# Altium schematic sheet Esquematico.SchDoc
size A4; SheetNumber: 1; SheetTotal: 2; SPICEModelCacheQUZINIZP: <root> / <DocumentId>QUZINIZP</DocumentId> / </root>
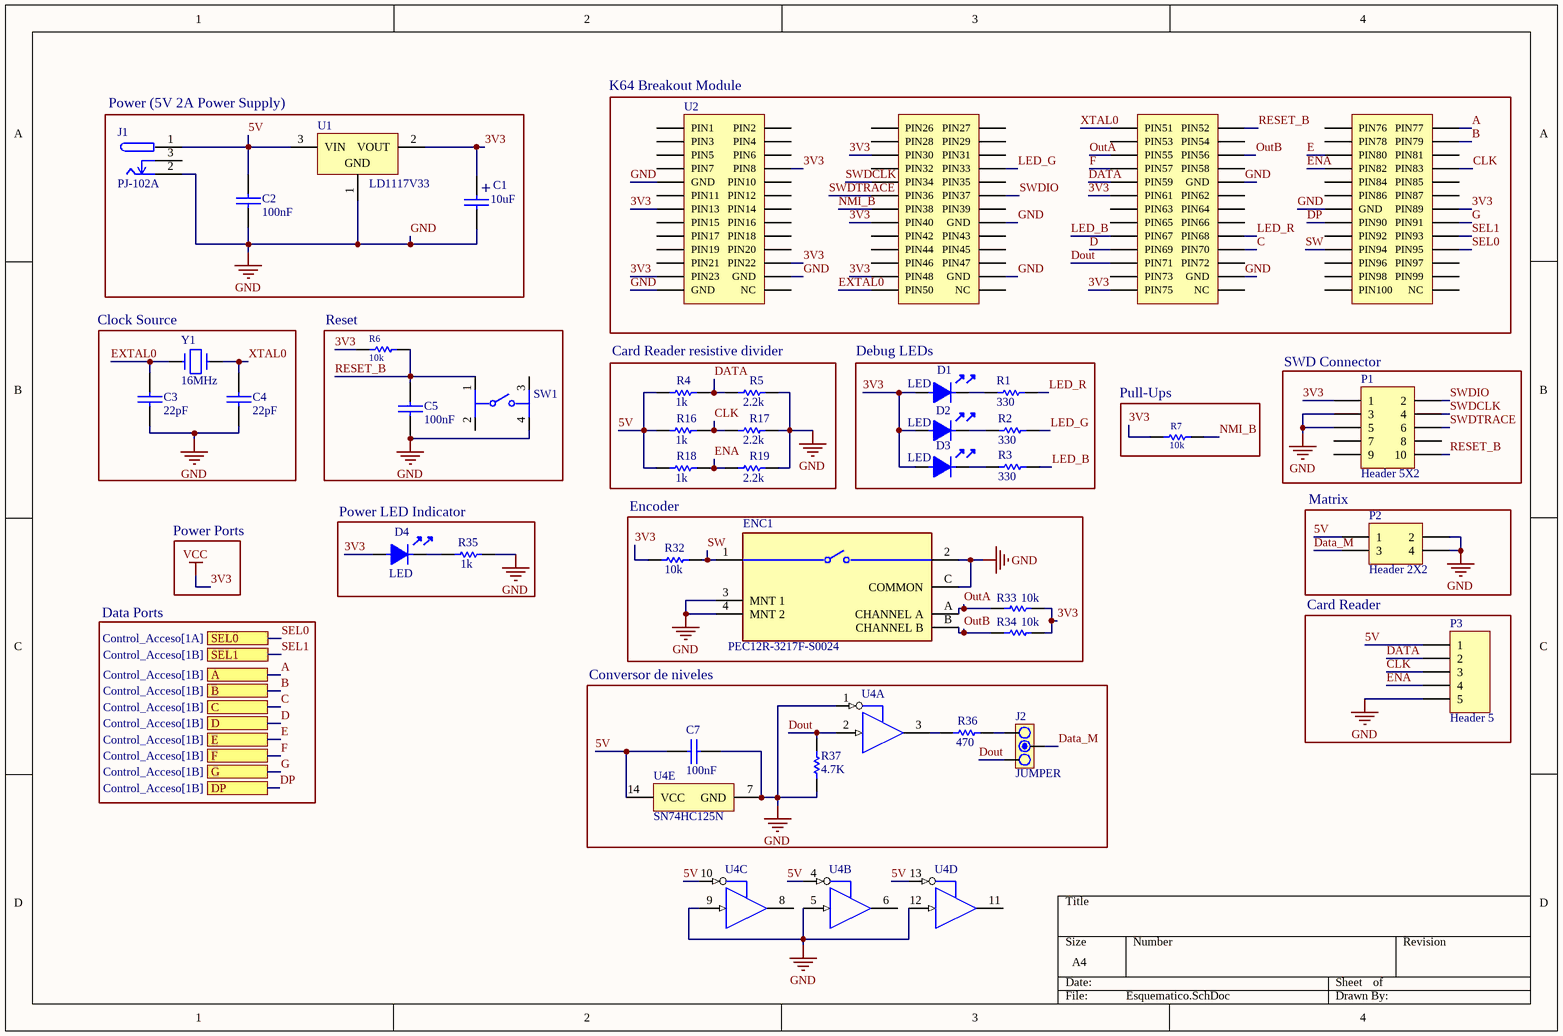
[diagram p0: Esquematico.SchDoc]

## Parts
C1  10uF  [CAP100RP]
C2  100nF  [CAP200]
C3  22pF  [CAP200]
C4  22pF  [CAP200]
C5  100nF  [CAP200]
C7  100nF  [CAP200]
D1  LED  [LED3]
D2  LED  [LED3]
D3  LED  [LED3]
D4  LED  [LED3]
ENC1  PEC12R-3217F-S0024  [FP-PEC12R-3217F-S0024-MFG]
J1  PJ-102A  [FP-PJ-102A-MFG]
J2  JUMPER  [JUMPER3]
P1  Header 5X2  [HDR2X5]
P2  Header 2X2  [HDR2X2]
P3  Header 5  [HDR1X5]
R1  330  [RES400]
R2  330  [RES400]
R3  330  [RES400]
R4  1k  [RES400]
R5  2.2k  [RES400]
R6  10k  [RES400]
R7  10k  [RES400]
R16  1k  [RES400]
R17  2.2k  [RES400]
R18  1k  [RES400]
R19  2.2k  [RES400]
R32  10k  [RES400]
R33  10k  [RES400]
R34  10k  [RES400]
R35  1k  [RES400]
R36  470  [RES400]
R37  4.7K  [RES400]
SW1  (no value)  [FP-B3F-1055-MFG]
U1  LD1117V33  [TO220]
U2  K64 Breakout Module  [Breakout]
U4  (no value)  [N0014A]  (parts A,B,C,D,E of 5)
Y1  16MHz  [CRISTAL PERFIL]

## Blocks framed on the sheet
Power (5V 2A Power Supply): C1 C2 J1 U1
Clock Source: C3 C4 Y1
Reset: C5 R6 SW1
Card Reader resistive divider: R4 R5 R16-R19
Debug LEDs: D1-D3 R1-R3
Pull-Ups: R7
SWD Connector: P1
Encoder: ENC1 R32-R34
Matrix: P2
Power LED Indicator: D4 R35
Card Reader: P3
Conversor de niveles: C7 J2 R36 R37 U4

## Ports
A (see Control_Acceso[1B]), B (see Control_Acceso[1B]), C (see Control_Acceso[1B]), D (see Control_Acceso[1B]), DP (see Control_Acceso[1B]), E (see Control_Acceso[1B]), F (see Control_Acceso[1B]), G (see Control_Acceso[1B]), SEL0 (see Control_Acceso[1A]), SEL1 (see Control_Acceso[1B])

## Nets
3V3: C1.1 D1.1 D2.1 D3.1 D4.1 P1.1 R6.2 R7.2 R32.1 R33.2 R34.1 U1.2(VOUT) U2.8(PIN8) U2.13(PIN13) U2.22(PIN22) U2.23(PIN23) U2.31(PIN30) U2.41(PIN40) U2.49(PIN48) U2.63(PIN61) U2.77(PIN75) U2.92(PIN89)  [also labelled VCC]
GND: C1.2 C2.2 C3.2 C4.2 C5.2 C7.2 ENC1.2 ENC1.3(MNT_1) ENC1.4(MNT_2) ENC1.C(COMMON) J1.2 P1.3 P1.5 P2.2 P2.4 P3.5 R5.2 R17.2 R19.2 R35.2 R37.1 SW1.4 U1.1(GND) U2.9(GND) U2.24(GND) U2.25(GND) U2.42(GND) U2.50(GND) U2.62(GND) U2.76(GND) U2.91(GND) U4.1(1~{OE}) U4.5(2A) U4.7(GND) U4.9(3A) U4.12(4A)
5V: C2.1 C7.1 J1.1 P2.1 P3.1 R4.1 R16.1 R18.1 U1.3(VIN) U4.4(2~{OE}) U4.10(3~{OE}) U4.13(4~{OE}) U4.14(VCC)
A: U2.80(PIN77) ; port A
B: U2.82(PIN79) ; port B
C: U2.72(PIN70) ; port C
CLK: P3.3 R16.2 R17.1 U2.86(PIN83)
D: U2.71(PIN69) ; port D
DATA: P3.2 R4.2 R5.1 U2.61(PIN59)
Data_M: J2.2 P2.3
Dout: J2.1 R37.2 U2.73(PIN71) U4.2(1A)
DP: U2.93(PIN90) ; port DP
E: U2.83(PIN80) ; port E
ENA: P3.4 R18.2 R19.1 U2.85(PIN82)
EXTAL0: C3.1 U2.51(PIN50) Y1.1
F: U2.59(PIN57) ; port F
G: U2.94(PIN91) ; port G
LED_B: R3.2 U2.69(PIN67)
LED_G: R2.2 U2.34(PIN33)
LED_R: R1.2 U2.70(PIN68)
NMI_B: R7.1 U2.39(PIN38)
OutA: ENC1.A(CHANNEL_A) R33.1 U2.57(PIN55)
OutB: ENC1.B(CHANNEL_B) R34.2 U2.58(PIN56)
RESET_B: C5.1 P1.10 R6.1 SW1.1 U2.54(PIN52)
SEL0: U2.98(PIN95) ; port SEL0
SEL1: U2.96(PIN93) ; port SEL1
SW: ENC1.1 R32.2 U2.97(PIN94)
SWDCLK: P1.4 U2.35(PIN34)
SWDIO: P1.2 U2.38(PIN37)
SWDTRACE: P1.6 U2.37(PIN36)
XTAL0: C4.1 U2.53(PIN51) Y1.2
NetD1_2: D1.2 R1.1
NetD2_2: D2.2 R2.1
NetD3_2: D3.2 R3.1
NetD4_2: D4.2 R35.1
NetJ2_3: J2.3 R36.1
NetR36_2: R36.2 U4.3(1Y)

Not connected (* = marked no-connect by the designer): J1 3; P1 7 8 9; SW1 2 3; U2 1(PIN1) 2(PIN2) 3(PIN3) 4(PIN4) 5(PIN5) 6(PIN6) 7(PIN7) 10(PIN10) 11(PIN11) 12(PIN12) 14(PIN14) 15(PIN15) 16(PIN16) 17(PIN17) 18(PIN18) 19(PIN19) 20(PIN20) 21(PIN21) 26(NC) 27(PIN26) 28(PIN27) 29(PIN28) 30(PIN29) 32(PIN31) 33(PIN32) 36(PIN35) 40(PIN39) 43(PIN42) 44(PIN43) 45(PIN44) 46(PIN45) 47(PIN46) 48(PIN47) 52(NC) 55(PIN53) 56(PIN54) 60(PIN58) 64(PIN62) 65(PIN63) 66(PIN64) 67(PIN65) 68(PIN66) 74(PIN72) 75(PIN73) 78(NC) 79(PIN76) 81(PIN78) 84(PIN81) 87(PIN84) 88(PIN85) 89(PIN86) 90(PIN87) 95(PIN92) 99(PIN96) 100(PIN97) 101(PIN98) 102(PIN99) 103(PIN100) 104(NC); U4 6(2Y) 8(3Y) 11(4Y)

## Notes on the sheet
- Power Ports
- Data Ports
- (in symbol CAPPOL) +

## Library data of the parts
C1 = CAPPOL: Electrolytic Capacitor
C2-C5 C7 = CAP: Multilayer Ceramic Capacitor
D1 D4 = LED: 3mm LED RED
D2 = LED: 3mm LED GREEN
D3 = LED: 3mm LED BLUE
ENC1 = CMP-07421-000063-1: ROTARY ENCODER; Height: 13.4mm; Width: 12.5mm; Length: 23mm; RoHS Compliant: Yes
J1 = CMP-12637-106234071-1: PJ-102A 2.0 x 6.5 mm, 2.5 A, Horizontal, Through Hole, Tapered Pins, Dc Power Jack Connector; Voltage Rating (DC): 24V; Number of Contacts: 3; Outside Diameter: 6.5mm; Gender: Male; Shielding: No; Insulation Resistance: 50MΩ; Current Rating: 2.5A; Inside Diameter: 2mm; Number of Conductors: 2; Housing Color: Black; RoHS: Compliant; Diameter: 2.1mm; Mount: Through Hole; Contact Plating: Nickel; NexarPartId: 106234071; Voltage Rating: 24V; Housing Material: Thermoplastic; Max Operating Temperature: 85°C; Color: Black; Contact Material: Copper, Nickel, Tin; Orientation: Horizontal; Packaging: Bulk; Flammability Rating: UL94 V-0; Schedule B: 8536695050, 8536695050; Contact Gender: Male; Lead Free: Lead Free; Termination: Through Hole; Min Operating Temperature: -25°C; Height: 11.2mm; Lifecycle Status: Production
J2 = JUMPER3
P1 = Header 5X2: Header, 5-Pin, Dual row; LatestRevisionDate: 17-Jul-2002; LatestRevisionNote: Re-released for DXP Platform.; Publisher: Altium Limited
P2 = Header 2X2: Header, 2-Pin, Dual row; LatestRevisionDate: 17-Jul-2002; LatestRevisionNote: Re-released for DXP Platform.; Publisher: Altium Limited
P3 = Header 5: Header, 5-Pin; LatestRevisionDate: 17-Jul-2002; LatestRevisionNote: Re-released for DXP Platform.; Publisher: Altium Limited
R1-R7 R16-R19 R32-R37 = RES: Through Hole Resistor 1/8W Carbon Film
SW1 = CMP-08834-000061-1: SWITCH TACTILE SPST-NO 0.05A 24V; Switch Travel: 0.25mm; Mechanical Life: 100000Cycles; Max Current Rating: 50mA; Actuator Color: Orange; Throw Configuration: SPST; Switch Function: Off-Mom; Contact Resistance: 100mR; Number of Poles: 1; Operating Force: 2.55N; Illumination Type: Non-Illuminated; Electrical Life: 300000Cycles; Actuator Length: 3mm; Termination: PC Pins; Contact Plating: Silver; Depth: 6mm; Max Voltage Rating (DC): 24V; Voltage Rating (DC): 24V; Package Quantity: 1500; Lead Free: Lead Free; Min Operating Temperature: -25°C; Max Operating Temperature: 70°C; Mount: Through Hole; Series: B3F; Contact Current Rating: 50mA; Orientation: Straight; Width: 6mm; RoHS Compliant: Yes; Contact Type: 1 maker; Weight: 0.25g; Packaging: Bag; Contact Material: Gold; Length: 6mm; Height: 7.3mm; Current Rating: 50mA
U1 = CMP-0244-00470-1: Fixed Low Drop Positive Voltage Regulator, 3.3V, 3-Pin TO-220; PackageVersion: ver3.0; PackageDescription: TO, Thru-Hole, Vertical, Heatsink Mounted; 3 In-Line Leads; Pitch 2.54 mm; ComponentLink1Description: Manufacturer URL; ComponentLink3URL: http://www.st.com/internet/com/TECHNICAL_RESOURCES/TECHNICAL_LITERATURE/PACKAGE_INFORMATION/CD00004649.pdf; PackageReference: TO220; ComponentLink2URL: http://www.st.com/internet/com/TECHNICAL_RESOURCES/TECHNICAL_LITERATURE/DATASHEET/CD00000544.pdf; ComponentLink3Description: Package Specification; ComponentLink2Description: Datasheet; ComponentLink1URL: http://www.st.com; DatasheetVersion: 1/11/2011
U2 = Breakout: Breakout Module Socket
U4 = CMP-0440-00135-3: Quadruple Bus Buffer Gates With 3-State Outputs, N0014A, TUBE; Generic Part Number: SN74HC125; Manufacturer: Texas Instruments; Rating: Catalog; Input Type: CMOS; Bits(#): 4; tpd @ Nom Voltage(Max)(ns): 26; VCC(Max)(V): 6; F @ Nom Voltage(Max)(Mhz): 28; VCC(Min)(V): 2; ICC @ Nom Voltage(Max)(mA): 0.16; PackageReference: N0014A; DatasheetVersion: SCLS104D; PackageVersion: http://www.ti.com/lit/ml/mpdi002c/mpdi002c.pdf; Output Type: CMOS; Operating Temperature Range(C): -40 to 85; Code_JEDEC: MS-001; Voltage(Nom)(V): 6
Y1 = CRISTAL: Cristal 16MHz